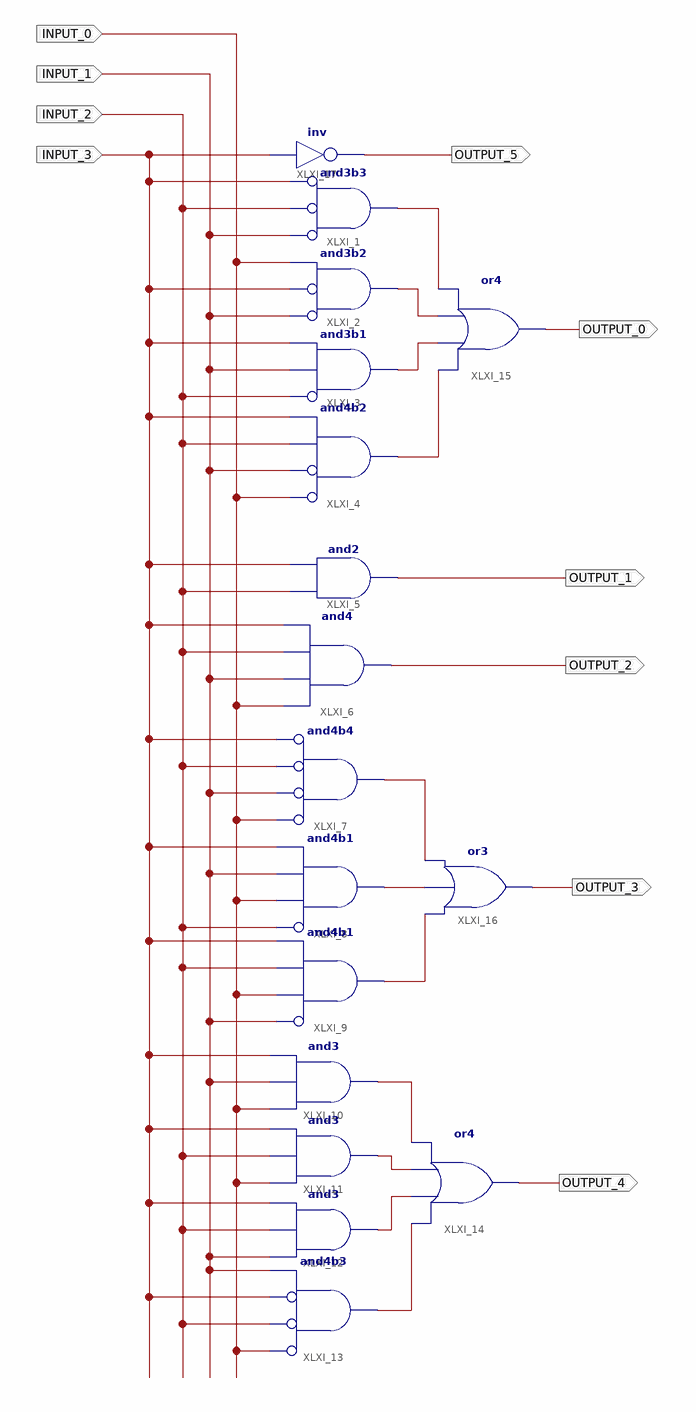
[diagram p0: schematic sheet 1]
// Xilinx ISE schematic Decoder4to6.sch (spartan3a) as structural Verilog: 17 symbols, 10 ports
module Decoder4to6 (
  input  INPUT_0,
  input  INPUT_1,
  input  INPUT_2,
  input  INPUT_3,
  output OUTPUT_0,
  output OUTPUT_1,
  output OUTPUT_2,
  output OUTPUT_3,
  output OUTPUT_4,
  output OUTPUT_5
);

  wire XLXN_5, XLXN_6, XLXN_7, XLXN_8, XLXN_12, XLXN_13, XLXN_14, XLXN_16, XLXN_17, XLXN_18, XLXN_19;

  and XLXI_1 (XLXN_5, ~INPUT_1, ~INPUT_2, ~INPUT_3);  // and3b3
  and XLXI_2 (XLXN_6, ~INPUT_1, ~INPUT_3, INPUT_0);  // and3b2
  and XLXI_3 (XLXN_7, ~INPUT_2, INPUT_1, INPUT_3);  // and3b1
  and XLXI_4 (XLXN_8, ~INPUT_0, ~INPUT_1, INPUT_2, INPUT_3);  // and4b2
  and XLXI_5 (OUTPUT_1, INPUT_2, INPUT_3);
  and XLXI_6 (OUTPUT_2, INPUT_0, INPUT_1, INPUT_2, INPUT_3);
  and XLXI_7 (XLXN_12, ~INPUT_0, ~INPUT_1, ~INPUT_2, ~INPUT_3);  // and4b4
  and XLXI_8 (XLXN_13, ~INPUT_2, INPUT_0, INPUT_1, INPUT_3);  // and4b1
  and XLXI_9 (XLXN_14, ~INPUT_1, INPUT_0, INPUT_2, INPUT_3);  // and4b1
  and XLXI_10 (XLXN_16, INPUT_0, INPUT_1, INPUT_3);
  and XLXI_11 (XLXN_17, INPUT_0, INPUT_2, INPUT_3);
  and XLXI_12 (XLXN_18, INPUT_1, INPUT_2, INPUT_3);
  and XLXI_13 (XLXN_19, ~INPUT_0, ~INPUT_2, ~INPUT_3, INPUT_1);  // and4b3
  or XLXI_14 (OUTPUT_4, XLXN_19, XLXN_18, XLXN_17, XLXN_16);
  or XLXI_15 (OUTPUT_0, XLXN_8, XLXN_7, XLXN_6, XLXN_5);
  or XLXI_16 (OUTPUT_3, XLXN_14, XLXN_13, XLXN_12);
  not XLXI_17 (OUTPUT_5, INPUT_3);
endmodule
